# EAGLE design Firmware Update Board (EAGLE 9.4.2)
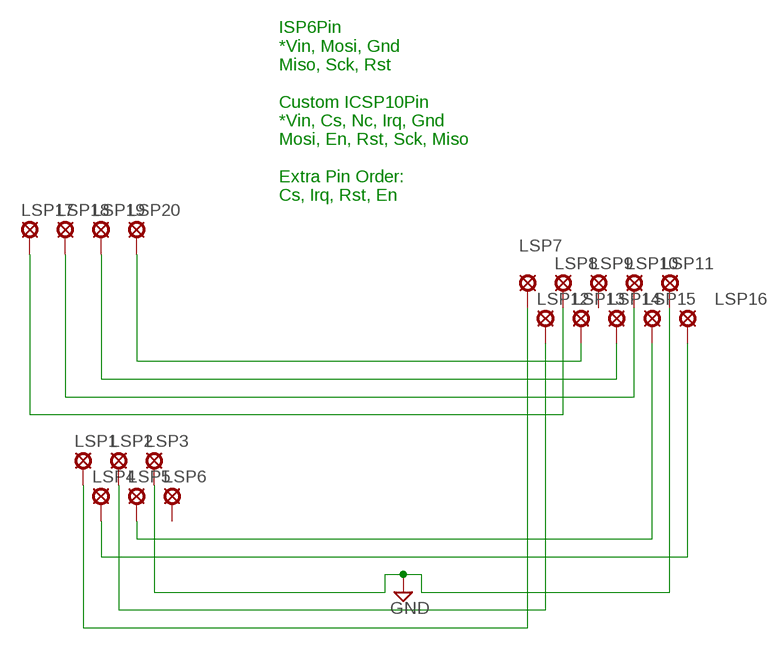
[diagram p0: schematic, sheet 1]

## Parts
LSP1  LSP10_CLSP10_C  [LSP10_C]
LSP2  LSP10_CLSP10_C  [LSP10_C]
LSP3  LSP10_CLSP10_C  [LSP10_C]
LSP4  LSP10_CLSP10_C  [LSP10_C]
LSP5  LSP10_CLSP10_C  [LSP10_C]
LSP6  LSP10_CLSP10_C  [LSP10_C]
LSP7  LSP10_CLSP10_C  [LSP10_C]
LSP8  LSP10_CLSP10_C  [LSP10_C]
LSP9  LSP10_CLSP10_C  [LSP10_C]
LSP10  LSP10_CLSP10_C  [LSP10_C]
LSP11  LSP10_CLSP10_C  [LSP10_C]
LSP12  LSP10_CLSP10_C  [LSP10_C]
LSP13  LSP10_CLSP10_C  [LSP10_C]
LSP14  LSP10_CLSP10_C  [LSP10_C]
LSP15  LSP10_CLSP10_C  [LSP10_C]
LSP16  LSP10_CLSP10_C  [LSP10_C]
LSP17  LSP10_CLSP10_C  [LSP10_C]
LSP18  LSP10_CLSP10_C  [LSP10_C]
LSP19  LSP10_CLSP10_C  [LSP10_C]
LSP20  LSP10_CLSP10_C  [LSP10_C]

## Nets
GND: LSP3.P$1(MP) LSP11.P$1(MP)
N$1: LSP1.P$1(MP) LSP7.P$1(MP)
N$2: LSP2.P$1(MP) LSP12.P$1(MP)
N$4: LSP4.P$1(MP) LSP16.P$1(MP)
N$5: LSP5.P$1(MP) LSP15.P$1(MP)
N$6: LSP13.P$1(MP) LSP20.P$1(MP)
N$7: LSP14.P$1(MP) LSP19.P$1(MP)
N$8: LSP10.P$1(MP) LSP18.P$1(MP)
N$9: LSP8.P$1(MP) LSP17.P$1(MP)
Unconnected: LSP6.P$1(MP) LSP9.P$1(MP)

## Notes on the sheet
- ISP6Pin
  *Vin, Mosi, Gnd
  Miso, Sck, Rst
  
  Custom ICSP10Pin
  *Vin, Cs, Nc, Irq, Gnd
  Mosi, En, Rst, Sck, Miso
  
  Extra Pin Order:
  Cs, Irq, Rst, En

## Library data of the parts
LSP1-LSP20 = tbtaco-solpad:LSP10_C: SOLDER PAD drill 1.0 mm, distributor Buerklin, 12H555

## Board
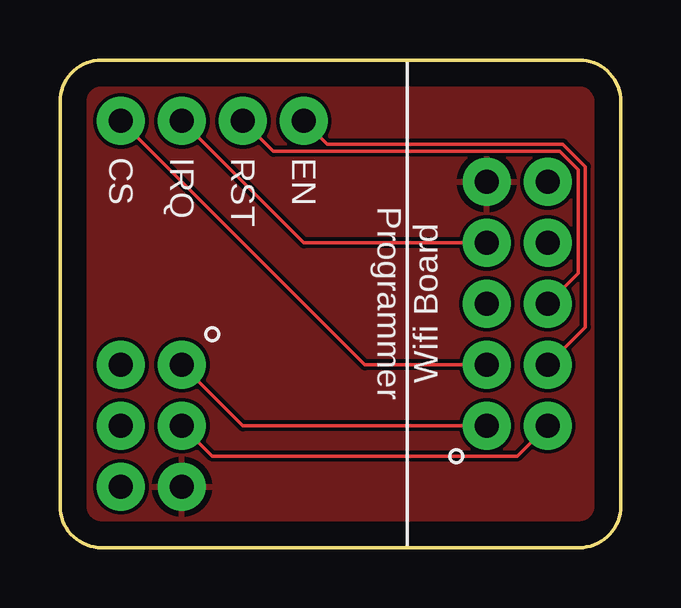
[diagram p1: board, top side]
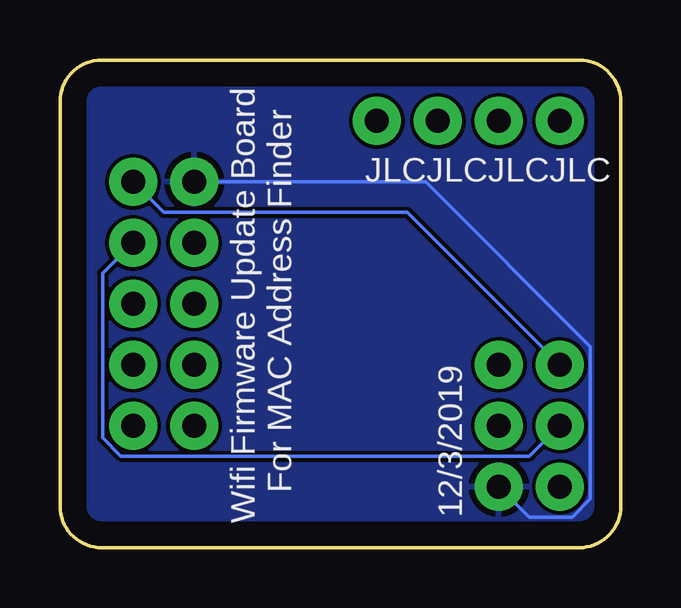
[diagram p2: board, bottom side, seen from below]

Size 23.37 x 20.32 mm. Coordinates in mm from the lower left corner, seen from the top.
Outline: 21.63,0 1.73,0 arc-90 0,1.73 0,18.59 arc-90 1.73,20.32 21.63,20.32 arc-90 23.37,18.59 23.37,1.73 arc-90 21.63,0
Copper layers (1*16): Top 0.035mm / dielectric 1.5mm / Bottom 0.035mm
Design rules "default": minimum track width 6mil, minimum drill 0.35mm, track to track 6mil, track to pad 6mil, pad to pad 6mil, via to via 6mil, smd to smd 6mil, copper to edge 40mil, drill to drill 6mil, minimum pad ring 10mil, minimum via ring 8mil, stop-mask expansion 4mil, vias tented up to drill 0mil, thermal gap 10mil

### Footprints (pad centres in the part's own frame; a part is rotated, then mirrored left to right if it is on the bottom)
LSP10_C = drill 1 pad 2: P$1 0,0

### Placement (x,y rotation side)
LSP1  5.08,7.62 0 top
LSP2  5.08,5.08 0 top
LSP3  5.08,2.54 0 top
LSP4  2.54,7.62 0 top
LSP5  2.54,5.08 0 top
LSP6  2.54,2.54 0 top
LSP7  17.78,5.08 0 top
LSP8  17.78,7.62 0 top
LSP9  17.78,10.16 0 top
LSP10  17.78,12.7 0 top
LSP11  17.78,15.24 0 top
LSP12  20.32,5.08 0 top
LSP13  20.32,7.62 0 top
LSP14  20.32,10.16 0 top
LSP15  20.32,12.7 0 top
LSP16  20.32,15.24 0 top
LSP17  2.54,17.78 0 top
LSP18  5.08,17.78 0 top
LSP19  7.62,17.78 0 top
LSP20  10.16,17.78 0 top

### Tracks (layer width: path | path; a pad name or v marks a point on that pad's centre or on a via)
GND
  Bottom 0.152: LSP11.P$1 8.13,15.24 1.27,8.38 1.27,2.03 2.03,1.27 3.81,1.27 LSP3.P$1
  pour Top: 0,20.32 23.37,20.32 23.37,1.02 23.37,0 5.84,0 0,0 0,8.13
  pour Bottom: 0,20.32 23.37,20.32 23.37,0 0,0
N$1
  Top 0.152: LSP7.P$1 7.62,5.08 LSP1.P$1
N$2
  Top 0.152: LSP12.P$1 19.05,3.81 6.35,3.81 LSP2.P$1
N$4
  Bottom 0.152: LSP16.P$1 19.05,13.97 8.89,13.97 LSP4.P$1
N$5
  Bottom 0.152: LSP15.P$1 21.59,11.43 21.59,4.57 20.83,3.81 3.81,3.81 LSP5.P$1
N$6
  Top 0.152: LSP13.P$1 21.89,9.2 21.89,15.87 20.95,16.81 11.12,16.81 LSP20.P$1
N$7
  Top 0.152: LSP14.P$1 21.59,11.43 21.59,15.75 20.83,16.51 8.89,16.51 LSP19.P$1
N$8
  Top 0.152: LSP10.P$1 10.16,12.7 LSP18.P$1
N$9
  Top 0.152: LSP8.P$1 12.7,7.62 LSP17.P$1

### Text on the board
tPlace: CS | IRQ | RST | EN | Programmer | Wifi Board
bPlace: JLCJLCJLCJLC | For MAC Address Finder | 12/3/2019 | Wifi Firmware Update Board